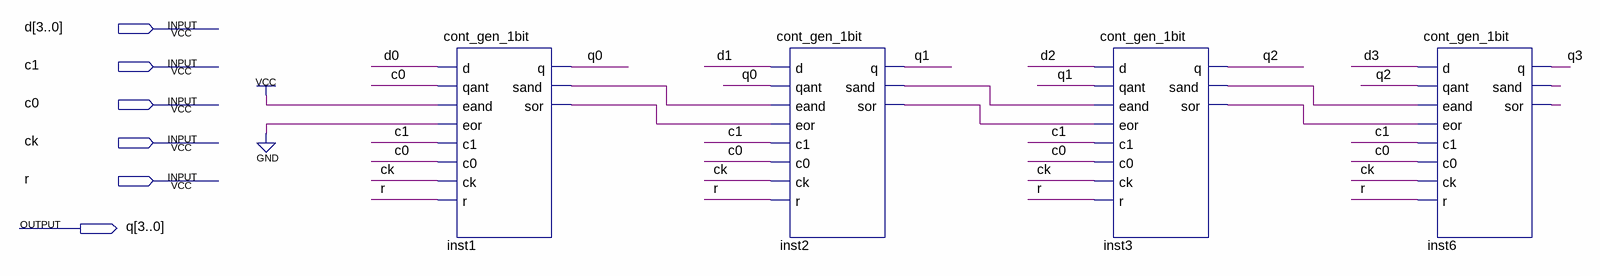
[diagram p0: schematic sheet]
// Quartus schematic cont_gen_4bits.bdf as structural Verilog: 4 symbols, 6 pins
module cont_gen_4bits (
  input  [3:0] d,
  input  c1,
  input  c0,
  input  ck,
  input  r,
  output [3:0] q
);

  wire inst1_sand, inst1_sor, inst2_sand, inst2_sor, inst3_sand, inst3_sor, inst6_sand, inst6_sor;

  cont_gen_1bit inst1 (
    .d(d[0]), .qant(c0), .eand(1'b1), .eor(1'b0), .c1(c1), .c0(c0), .ck(ck), .r(r), .q(q[0]),
    .sand(inst1_sand), .sor(inst1_sor));
  cont_gen_1bit inst2 (
    .d(d[1]), .qant(q[0]), .eand(inst1_sand), .eor(inst1_sor), .c1(c1), .c0(c0), .ck(ck), .r(r), .q(q[1]),
    .sand(inst2_sand), .sor(inst2_sor));
  cont_gen_1bit inst3 (
    .d(d[2]), .qant(q[1]), .eand(inst2_sand), .eor(inst2_sor), .c1(c1), .c0(c0), .ck(ck), .r(r), .q(q[2]),
    .sand(inst3_sand), .sor(inst3_sor));
  cont_gen_1bit inst6 (
    .d(d[3]), .qant(q[2]), .eand(inst3_sand), .eor(inst3_sor), .c1(c1), .c0(c0), .ck(ck), .r(r), .q(q[3]),
    .sand(inst6_sand), .sor(inst6_sor));
endmodule
